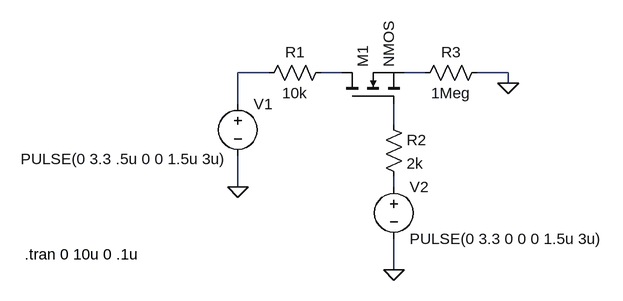
[diagram p0: schematic blanking.asc]
blanking.asc, the LTspice schematic file:
Version 4.1
SHEET 1 880 680
WIRE 96 112 48 112
WIRE 208 112 176 112
WIRE 336 112 304 112
WIRE 464 112 416 112
WIRE 464 128 464 112
WIRE 48 160 48 112
WIRE 288 192 288 160
WIRE 48 288 48 240
WIRE 288 288 288 272
WIRE 288 416 288 368
FLAG 464 128 0
FLAG 288 416 0
FLAG 48 288 0
SYMBOL voltage 48 144 R0
WINDOW 3 -334 101 Left 2
WINDOW 123 0 0 Left 0
WINDOW 39 0 0 Left 0
SYMATTR InstName V1
SYMATTR Value PULSE(0 3.3 .5u 0 0 1.5u 3u)
SYMBOL voltage 288 272 R0
WINDOW 123 0 0 Left 0
WINDOW 39 0 0 Left 0
SYMATTR InstName V2
SYMATTR Value PULSE(0 3.3 0 0 0 1.5u 3u)
SYMBOL nmos 208 160 R270
SYMATTR InstName M1
SYMBOL res 192 96 R90
WINDOW 0 0 56 VBottom 2
WINDOW 3 32 56 VTop 2
SYMATTR InstName R1
SYMATTR Value 10k
SYMBOL res 272 176 R0
SYMATTR InstName R2
SYMATTR Value 2k
SYMBOL res 432 96 R90
WINDOW 0 0 56 VBottom 2
WINDOW 3 32 56 VTop 2
SYMATTR InstName R3
SYMATTR Value 1Meg
TEXT -280 392 Left 2 !.tran 0 10u 0 .1u

The netlist it stands for:
* blanking.asc
V1 N001 0 PULSE(0 3.3 .5u 0 0 1.5u 3u)
V2 N005 0 PULSE(0 3.3 0 0 0 1.5u 3u)
M1 N002 N004 N003 N003 NMOS
R1 N002 N001 10k
R2 N004 N005 2k
R3 0 N003 1Meg
.model NMOS NMOS
.model PMOS PMOS
.lib standard.mos
.tran 0 10u 0 .1u
.backanno
.end